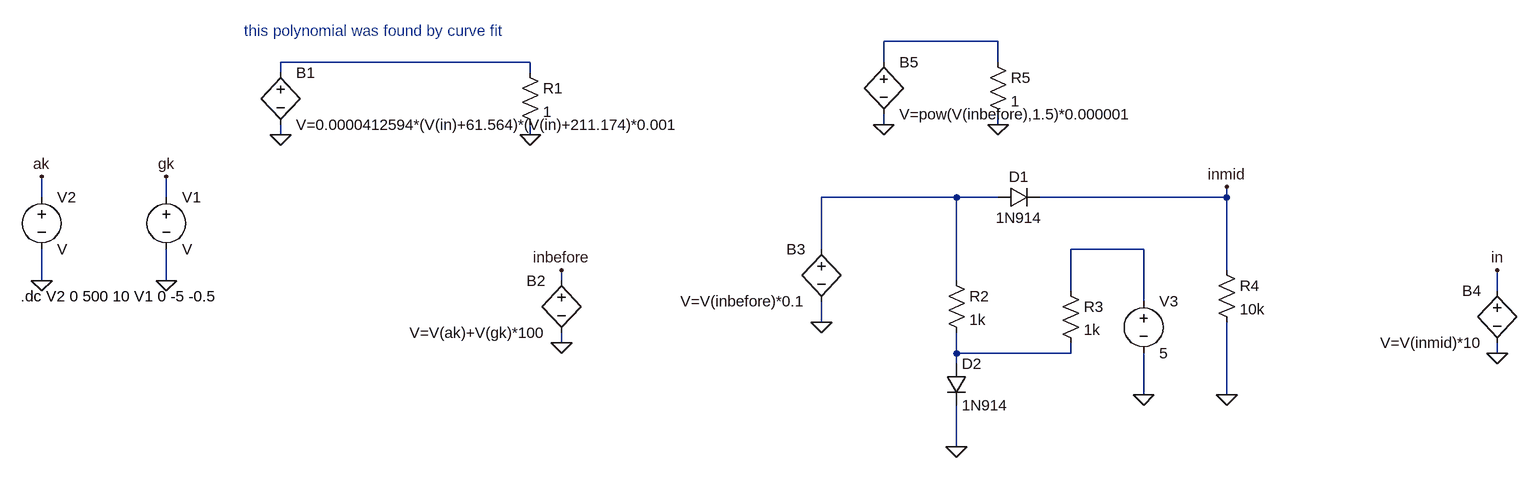
[diagram p0: schematic 12AX7_replica.asc]
12AX7_replica.asc, the LTspice schematic file:
Version 4
SHEET 1 2260 708
WIRE 1456 64 1280 64
WIRE 736 96 352 96
WIRE 1280 96 1280 64
WIRE 1456 96 1456 64
WIRE 352 112 352 96
WIRE 736 112 736 96
WIRE 1280 192 1280 176
WIRE 1456 192 1456 176
WIRE 352 208 352 192
WIRE 736 208 736 192
WIRE -16 304 -16 272
WIRE 176 304 176 272
WIRE 1392 304 1184 304
WIRE 1456 304 1392 304
WIRE 1808 304 1808 288
WIRE 1808 304 1520 304
WIRE 1184 384 1184 304
WIRE 1680 384 1568 384
WIRE 1808 416 1808 304
WIRE -16 432 -16 384
WIRE 176 432 176 384
WIRE 784 432 784 416
WIRE 1392 432 1392 304
WIRE 1568 448 1568 384
WIRE 2224 448 2224 416
WIRE 1680 464 1680 384
WIRE 1184 496 1184 464
WIRE 784 528 784 512
WIRE 1392 544 1392 512
WIRE 1568 544 1568 528
WIRE 1568 544 1392 544
WIRE 2224 544 2224 528
WIRE 1392 560 1392 544
WIRE 1680 608 1680 544
WIRE 1808 608 1808 496
WIRE 1392 688 1392 624
FLAG 352 208 0
FLAG 736 208 0
FLAG 784 528 0
FLAG -16 272 ak
FLAG 176 272 gk
FLAG 176 432 0
FLAG -16 432 0
FLAG 1680 608 0
FLAG 1392 688 0
FLAG 1808 608 0
FLAG 1808 288 inmid
FLAG 784 416 inbefore
FLAG 1184 496 0
FLAG 2224 544 0
FLAG 2224 416 in
FLAG 1280 192 0
FLAG 1456 192 0
SYMBOL voltage 176 288 R0
SYMATTR InstName V1
SYMBOL voltage -16 288 R0
SYMATTR InstName V2
SYMBOL bv 352 96 R0
SYMATTR InstName B1
SYMATTR Value V=0.0000412594*(V(in)+61.564)*(V(in)+211.174)*0.001
SYMBOL res 720 96 R0
SYMATTR InstName R1
SYMATTR Value 1
SYMBOL bv 784 416 M0
SYMATTR InstName B2
SYMATTR Value V=V(ak)+V(gk)*100
SYMBOL diode 1456 320 R270
WINDOW 0 32 32 VTop 2
WINDOW 3 0 32 VBottom 2
SYMATTR InstName D1
SYMATTR Value 1N914
SYMBOL diode 1376 560 R0
SYMATTR InstName D2
SYMATTR Value 1N914
SYMBOL res 1376 416 R0
SYMATTR InstName R2
SYMATTR Value 1k
SYMBOL res 1552 432 R0
SYMATTR InstName R3
SYMATTR Value 1k
SYMBOL voltage 1680 448 R0
WINDOW 123 0 0 Left 0
WINDOW 39 0 0 Left 0
SYMATTR InstName V3
SYMATTR Value 5
SYMBOL res 1792 400 R0
SYMATTR InstName R4
SYMATTR Value 10k
SYMBOL bv 1184 368 M0
SYMATTR InstName B3
SYMATTR Value V=V(inbefore)*0.1
SYMBOL bv 2224 432 M0
SYMATTR InstName B4
SYMATTR Value V=V(inmid)*10
SYMBOL bv 1280 80 R0
SYMATTR InstName B5
SYMATTR Value V=pow(V(inbefore),1.5)*0.000001
SYMBOL res 1440 80 R0
SYMATTR InstName R5
SYMATTR Value 1
TEXT -48 456 Left 2 !.dc V2 0 500 10 V1 0 -5 -0.5
TEXT 296 48 Left 2 ;this polynomial was found by curve fit

The netlist it stands for:
* 12AX7_replica.asc
V1 gk 0 V
V2 ak 0 V
B1 N002 0 V=0.0000412594*(V(in)+61.564)*(V(in)+211.174)*0.001
R1 N002 0 1
B2 inbefore 0 V=V(ak)+V(gk)*100
D1 N003 inmid 1N914
D2 N005 0 1N914
R2 N003 N005 1k
R3 N004 N005 1k
V3 N004 0 5
R4 inmid 0 10k
B3 N003 0 V=V(inbefore)*0.1
B4 in 0 V=V(inmid)*10
B5 N001 0 V=pow(V(inbefore),1.5)*0.000001
R5 N001 0 1
.model D D
.lib standard.dio
.dc V2 0 500 10 V1 0 -5 -0.5
* this polynomial was found by curve fit
.backanno
.end

* Results of the author's LTspice run, read from the files saved beside the schematic
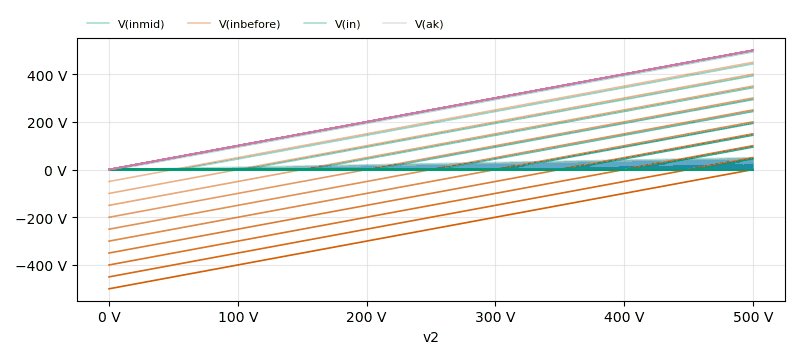
[diagram p1: DC transfer characteristic of 12AX7_replica.asc, plotted from the saved traces]
* DC transfer characteristic, 11 runs:
*   V(inmid) [v1=0]: -8.145e-08 fV at v2=0 V, 49.34 V at v2=500 V, min -8.145e-08 fV, max 49.34 V
*   V(inmid) [v1=-0.5]: -25.25 µV at v2=0 V, 44.35 V at v2=500 V, min -25.25 µV, max 44.35 V
*   V(inmid) [v1=-1]: -25.3 µV at v2=0 V, 39.35 V at v2=500 V, min -25.3 µV, max 39.35 V
*   V(inmid) [v1=-1.5]: -25.35 µV at v2=0 V, 34.36 V at v2=500 V, min -25.35 µV, max 34.36 V
*   V(inmid) [v1=-2]: -25.4 µV at v2=0 V, 29.37 V at v2=500 V, min -25.4 µV, max 29.37 V
*   V(inmid) [v1=-2.5]: -25.45 µV at v2=0 V, 24.37 V at v2=500 V, min -25.45 µV, max 24.37 V
*   V(inmid) [v1=-3]: -25.5 µV at v2=0 V, 19.38 V at v2=500 V, min -25.5 µV, max 19.38 V
*   V(inmid) [v1=-3.5]: -25.55 µV at v2=0 V, 14.4 V at v2=500 V, min -25.55 µV, max 14.4 V
*   V(inbefore) [v1=0]: 0 V at v2=0 V, 500 V at v2=500 V, min 0 V, max 500 V
*   V(inbefore) [v1=-0.5]: -50 V at v2=0 V, 450 V at v2=500 V, min -50 V, max 450 V
*   V(inbefore) [v1=-1]: -100 V at v2=0 V, 400 V at v2=500 V, min -100 V, max 400 V
*   V(inbefore) [v1=-1.5]: -150 V at v2=0 V, 350 V at v2=500 V, min -150 V, max 350 V
*   V(inbefore) [v1=-2]: -200 V at v2=0 V, 300 V at v2=500 V, min -200 V, max 300 V
*   V(inbefore) [v1=-2.5]: -250 V at v2=0 V, 250 V at v2=500 V, min -250 V, max 250 V
*   V(inbefore) [v1=-3]: -300 V at v2=0 V, 200 V at v2=500 V, min -300 V, max 200 V
*   V(inbefore) [v1=-3.5]: -350 V at v2=0 V, 150 V at v2=500 V, min -350 V, max 150 V
*   V(in) [v1=0]: -8.145e-07 fV at v2=0 V, 493.4 V at v2=500 V, min -8.145e-07 fV, max 493.4 V
*   V(in) [v1=-0.5]: -252.5 µV at v2=0 V, 443.5 V at v2=500 V, min -252.5 µV, max 443.5 V
*   V(in) [v1=-1]: -253 µV at v2=0 V, 393.5 V at v2=500 V, min -253 µV, max 393.5 V
*   V(in) [v1=-1.5]: -253.5 µV at v2=0 V, 343.6 V at v2=500 V, min -253.5 µV, max 343.6 V
*   V(in) [v1=-2]: -254 µV at v2=0 V, 293.7 V at v2=500 V, min -254 µV, max 293.7 V
*   V(in) [v1=-2.5]: -254.5 µV at v2=0 V, 243.7 V at v2=500 V, min -254.5 µV, max 243.7 V
*   V(in) [v1=-3]: -255 µV at v2=0 V, 193.8 V at v2=500 V, min -255 µV, max 193.8 V
*   V(in) [v1=-3.5]: -255.5 µV at v2=0 V, 144 V at v2=500 V, min -255.5 µV, max 144 V
*   V(ak) [v1=0]: 0 V at v2=0 V, 500 V at v2=500 V, min 0 V, max 500 V
*   V(ak) [v1=-0.5]: 0 V at v2=0 V, 500 V at v2=500 V, min 0 V, max 500 V
*   V(ak) [v1=-1]: 0 V at v2=0 V, 500 V at v2=500 V, min 0 V, max 500 V
*   V(ak) [v1=-1.5]: 0 V at v2=0 V, 500 V at v2=500 V, min 0 V, max 500 V
*   V(ak) [v1=-2]: 0 V at v2=0 V, 500 V at v2=500 V, min 0 V, max 500 V
*   V(ak) [v1=-2.5]: 0 V at v2=0 V, 500 V at v2=500 V, min 0 V, max 500 V
*   V(ak) [v1=-3]: 0 V at v2=0 V, 500 V at v2=500 V, min 0 V, max 500 V
*   V(ak) [v1=-3.5]: 0 V at v2=0 V, 500 V at v2=500 V, min 0 V, max 500 V